# EAGLE schematic APP_UD_reduziert (EAGLE 6.1)
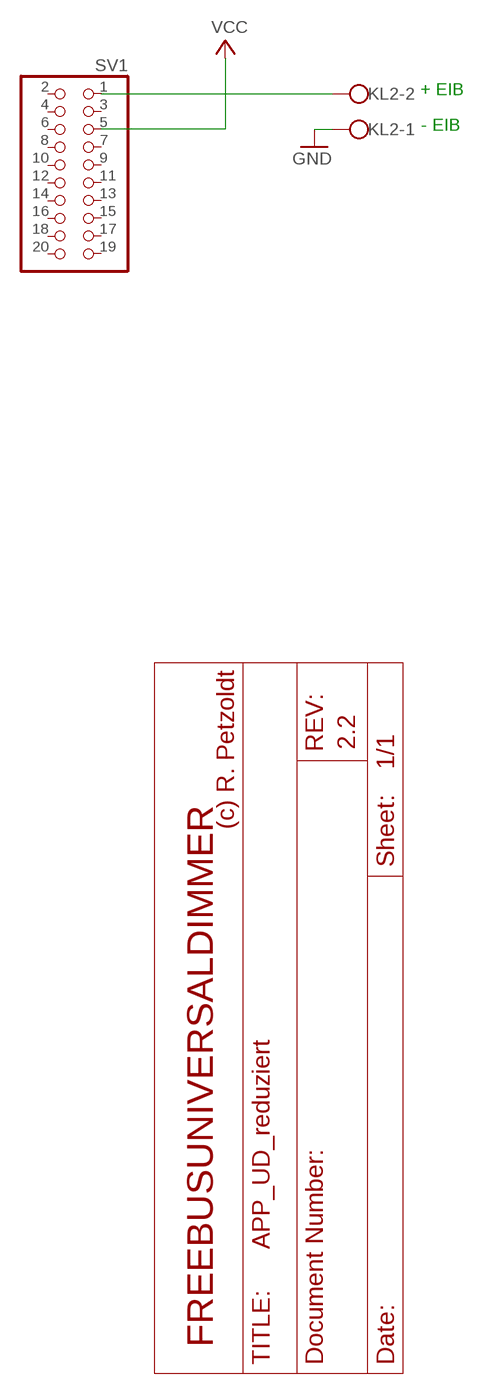
[diagram p0: schematic, sheet 1]
FREEBUSUNIVERSALDIMMER (DOCFIELD): COPYRIGHT: (c) R. Petzoldt; REV: 2.2

## Parts
KL2  W237-102  [W237-102]
SV1  PINHD-2X10  [2X10]

## Nets
GND: KL2.1
N$20: KL2.2 SV1.1
VCC: SV1.5
Unconnected: SV1.2 SV1.3 SV1.4 SV1.6 SV1.7 SV1.8 SV1.9 SV1.10 SV1.11 SV1.12 SV1.13 SV1.14 SV1.15 SV1.16 SV1.17 SV1.18 SV1.19 SV1.20

## Notes on the sheet
- + EIB
- - EIB

## Library data of the parts
KL2 = con-wago-500:W237-102: WAGO SCREW CLAMP
SV1 = pinhead:PINHD-2X10: PIN HEADER